# EAGLE design MintyCharger 9V (Rev A) (EAGLE 6.6.0)
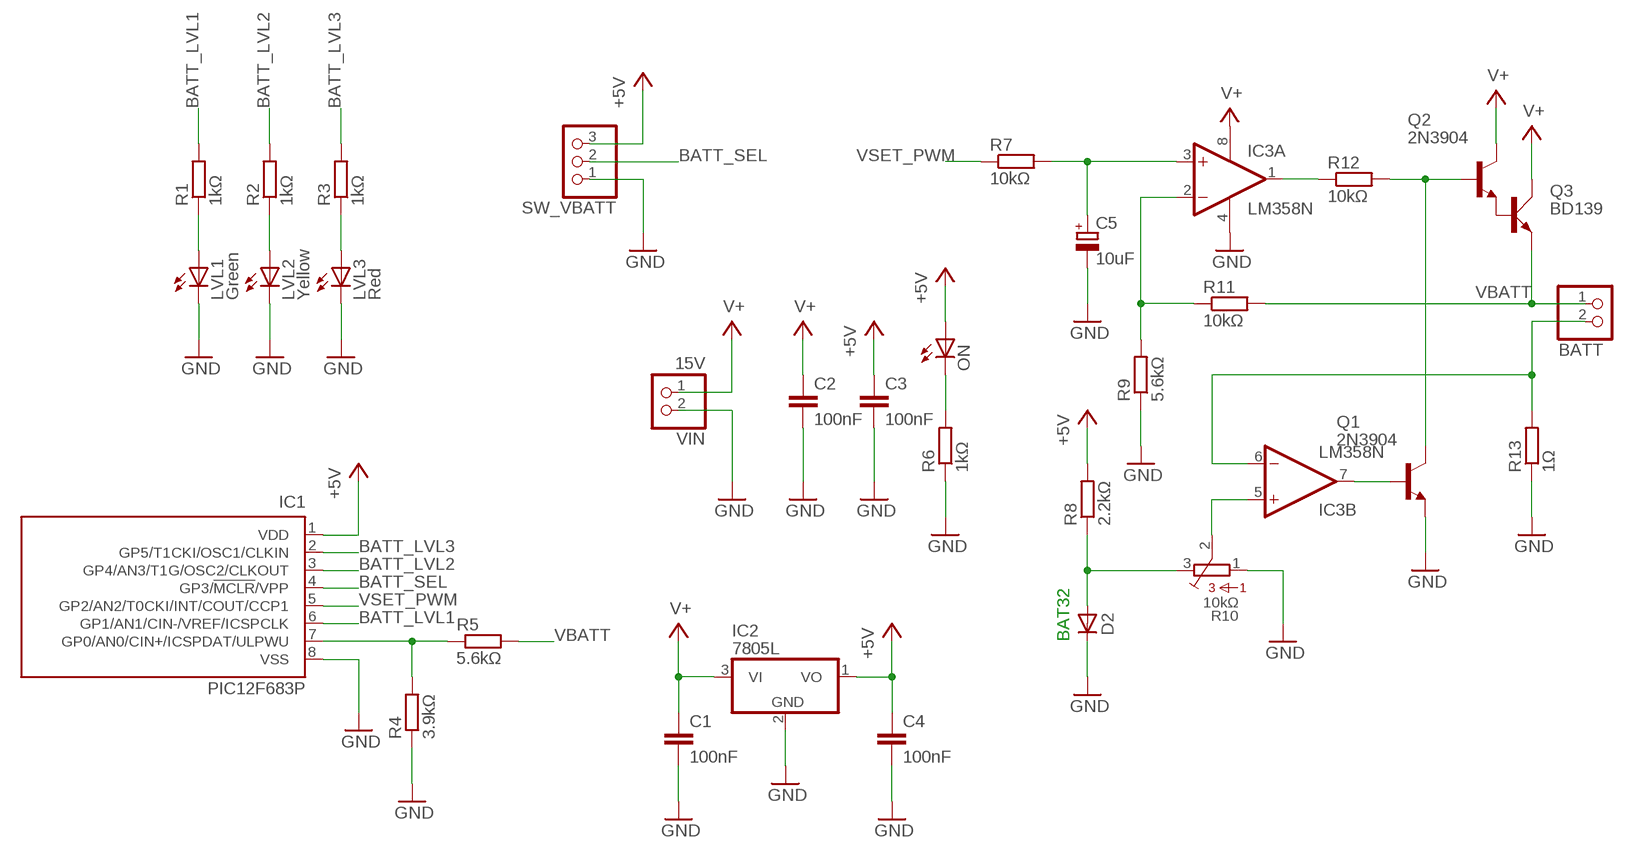
[diagram p0: schematic, sheet 1]

## Parts
BATT  JST_2PIN-THM  [JST-PH-2-THM]
C1  100nF  C-EU025-025X050  [C025-025X050]
C2  100nF  C-EU025-025X050  [C025-025X050]
C3  100nF  C-EU025-025X050  [C025-025X050]
C4  100nF  C-EU025-025X050  [C025-025X050]
C5  10uF  CPOL-EUE2.5-6  [E2,5-6]
D2  1N4148DO35-7  [DO35-7]
IC1  PIC12F683P  [DIL8]
IC2  7805L  [TO92]
IC3  LM358N  [DIL08]
LVL1  Green  LEDSQR2X5  [LED2X5]
LVL2  Yellow  LEDSQR2X5  [LED2X5]
LVL3  Red  LEDSQR2X5  [LED2X5]
ON  LEDSQR2X5  [LED2X5]
Q1  2N3904  [TO92]
Q2  2N3904  [TO92]
Q3  BD139  [TO126AV]
R1  1kΩ  R-EU_0207/10  [0207/10]
R2  1kΩ  R-EU_0207/10  [0207/10]
R3  1kΩ  R-EU_0207/10  [0207/10]
R4  3.9kΩ  R-EU_0207/10  [0207/10]
R5  5.6kΩ  R-EU_0207/10  [0207/10]
R6  1kΩ  R-EU_0207/10  [0207/10]
R7  10kΩ  R-EU_0207/10  [0207/10]
R8  2.2kΩ  R-EU_0207/10  [0207/10]
R9  5.6kΩ  R-EU_0207/10  [0207/10]
R10  10kΩ  3362U  [3362U]
R11  10kΩ  R-EU_0207/10  [0207/10]
R12  10kΩ  R-EU_0207/10  [0207/10]
R13  1Ω  R-EU_0207/10  [0207/10]
SW_VBATT  PINHD-1X3  [1X03]
VIN  15V  JST_2PIN-THM  [JST-PH-2-THM]

## Nets
+5V: C3.1 C4.1 IC1.1(VDD) IC2.1(VO) ON.A R8.2 SW_VBATT.3
BATT_LVL1: IC1.6(GP1/AN1/CIN-/VREF/ICSPCLK) R1.2
BATT_LVL2: IC1.3(GP4/AN3/T1G/OSC2/CLKOUT) R2.2
BATT_LVL3: IC1.2(GP5/T1CKI/OSC1/CLKIN) R3.2
BATT_SEL: IC1.4(GP3/!MCLR!/VPP) SW_VBATT.2
GND: C1.2 C2.2 C3.2 C4.2 C5.- D2.C IC1.8(VSS) IC2.2(GND) IC3.4(P:V-) LVL1.K(C) LVL2.K(C) LVL3.K(C) Q1.3(E) R4.1 R6.1 R9.1 R10.1 R13.1 SW_VBATT.1 VIN.2
ISENSE: BATT.2 IC3.6(B:-IN) R13.2
N$1: LVL1.A R1.1
N$2: IC3.2(A:-IN) R9.2 R11.1
N$3: IC3.1(A:OUT) R12.1
N$4: Q2.3(E) Q3.B
N$5: Q1.1(C) Q2.2(B) R12.2
N$6: IC3.7(B:OUT) Q1.2(B)
N$7: D2.A R8.1 R10.3
N$8: IC3.5(B:+IN) R10.2
N$9: IC1.7(GP0/AN0/CIN+/ICSPDAT/ULPWU) R4.2 R5.1
N$10: LVL2.A R2.1
N$11: LVL3.A R3.1
N$22: ON.K(C) R6.2
V+: C1.1 C2.1 IC2.3(VI) IC3.8(P:V+) Q2.1(C) Q3.C VIN.1
VBATT: BATT.1 Q3.E R5.2 R11.2
VOUT: C5.+ IC3.3(A:+IN) R7.2
VSET_PWM: IC1.5(GP2/AN2/T0CKI/INT/COUT/CCP1) R7.1

## Notes on the sheet
- BAT32

## Library data of the parts
BATT VIN = adafruit:JST_2PIN: JST 2-Pin Connectors of various flavors SMT-RA (S2B-PH-SM4) 4UConnector #17311 SMT (B2B-PH-SM4) THM-RA (S2B-PH) THM (B2B-PH)
C1-C4 = rcl:C-EU: CAPACITOR, European symbol
C5 = rcl:CPOL-EU: POLARIZED CAPACITOR, European symbol
D2 = diode:1N4148: DIODE high speed (Philips)
IC1 = microchip:PIC12F683: 8-Pin Flash-Based, 8-Bit CMOS Microcontrollers with nanoWatt Technology Source: http://ww1.microchip.com/downloads/en/DeviceDoc/41211D_.pdf; MF: MICROCHIP; MPN: PIC12F683-I/P; OC_FARNELL: 9759034; OC_NEWARK: 89H0442
IC2 = linear:78*: Positive VOLTAGE REGULATOR Source: http://cache.national.com/ds/LM/LM78L05.pdf http://www.fairchildsemi.com/ds/LM/LM7805.pdf
IC3 = linear:LM358: OP AMP also LM158; LM258; LM2904 Source: http://cache.national.com/ds/LM/LM158.pdf
LVL1-LVL3 ON = led:LED: LED OSRAM: - CHIPLED LG R971, LG N971, LY N971, LG Q971, LY Q971, LO R971, LY R971 LH N974, LH R974 LS Q976, LO Q976, LY Q976 LO Q996 - Hyper CHIPLED LW Q18S LB Q993, LB Q99A, LB R99A - SideLED LS A670, LO A670, LY A670, LG A670, LP A670 LB A673, LV A673, LT A673, LW A673 LH A674 LY A675 LS A676, LA A676, LO A676, LY A676, LW A676 LS A679, LY A679, LG A679 - Hyper Micro SIDELED® LS Y876, LA Y876, LO Y876, LY Y876 LT Y87S - SmartLED LW L88C, LW L88S LB L89C, LB L89S, LG L890 LS L89K, LO L89K, LY L89K LS L896, LA L896, LO L896, LY L896 - TOPLED LS T670, LO T670, LY T670, LG T670, LP T670 LSG T670, LSP T670, LSY T670, LOP T670, LYG T670 LG T671, LOG T671, LSG T671 LB T673, LV T673, LT T673, LW T673 LH T674 LS T676, LA T676, LO T676, LY T676, LB T676, LH T676, LSB T676, LW T676 LB T67C, LV T67C, LT T67C, LS T67K, LO T67K, LY T67K, LW E67C LS E67B, LA E67B, LO E67B, LY E67B, LB E67C, LV E67C, LT E67C LW T67C LS T679, LY T679, LG T679 LS T770, LO T770, LY T770, LG T770, LP T770 LB T773, LV T773, LT T773, LW T773 LH T774 LS E675, LA E675, LY E675, LS T675 LS T776, LA T776, LO T776, LY T776, LB T776 LHGB T686 LT T68C, LB T68C - Hyper Mini TOPLED® LB M676 - Mini TOPLED Santana® LG M470 LS M47K, LO M47K, LY M47K Source: http://www.osram.convergy.de LUXEON: - LUMILED® LXK2-PW12-R00, LXK2-PW12-S00, LXK2-PW14-U00, LXK2-PW14-V00 LXK2-PM12-R00, LXK2-PM12-S00, LXK2-PM14-U00 LXK2-PE12-Q00, LXK2-PE12-R00, LXK2-PE12-S00, LXK2-PE14-T00, LXK2-PE14-U00 LXK2-PB12-K00, LXK2-PB12-L00, LXK2-PB12-M00, LXK2-PB14-N00, LXK2-PB14-P00, LXK2-PB14-Q00 LXK2-PR12-L00, LXK2-PR12-M00, LXK2-PR14-Q00, LXK2-PR14-R00 LXK2-PD12-Q00, LXK2-PD12-R00, LXK2-PD12-S00 LXK2-PH12-R00, LXK2-PH12-S00 LXK2-PL12-P00, LXK2-PL12-Q00, LXK2-PL12-R00 Source: www.luxeon.com KINGBRIGHT: KA-3528ASYC Source: www.kingbright.com
Q1 Q2 = transistor-npn:2N3904: NPN Transistor
Q3 = transistor-power:BD139: NPN TRANSISTOR
R1-R4 R6 R8 R9 R11-R13 = rcl:R-EU_: RESISTOR, European symbol
R5 R7 = resistor:R-EU_: RESISTOR, European symbol
R10 = bourns:3362: 3362 Series 1/4" Square Trimmer
SW_VBATT = pinhead:PINHD-1X3: PIN HEADER

## Board
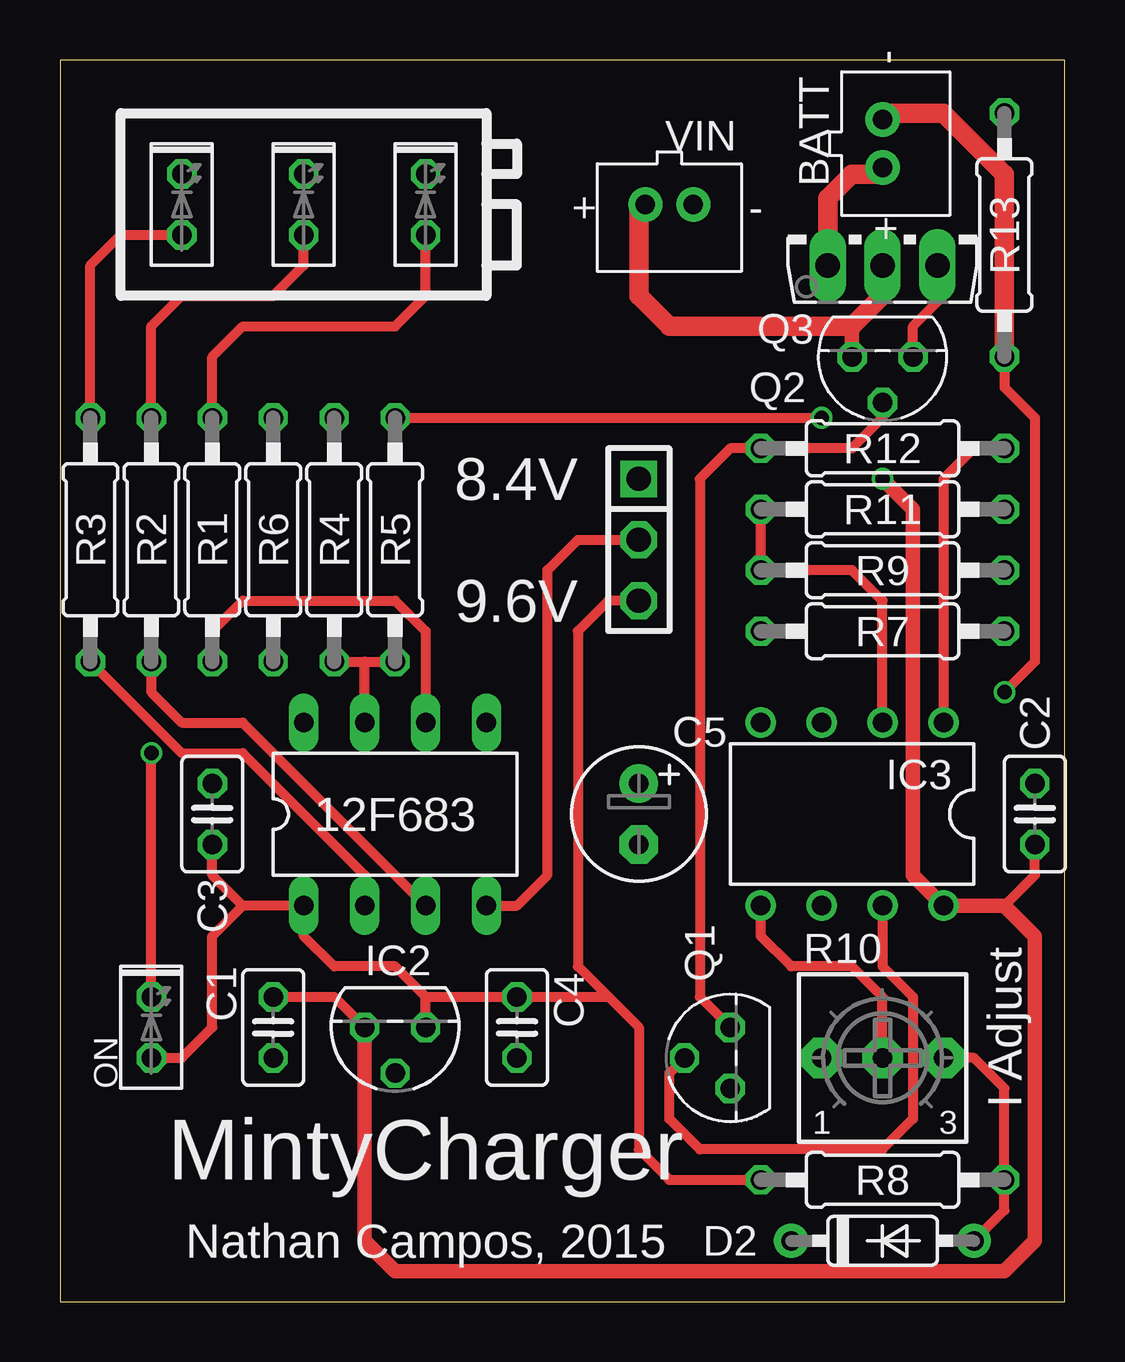
[diagram p1: board, top side]
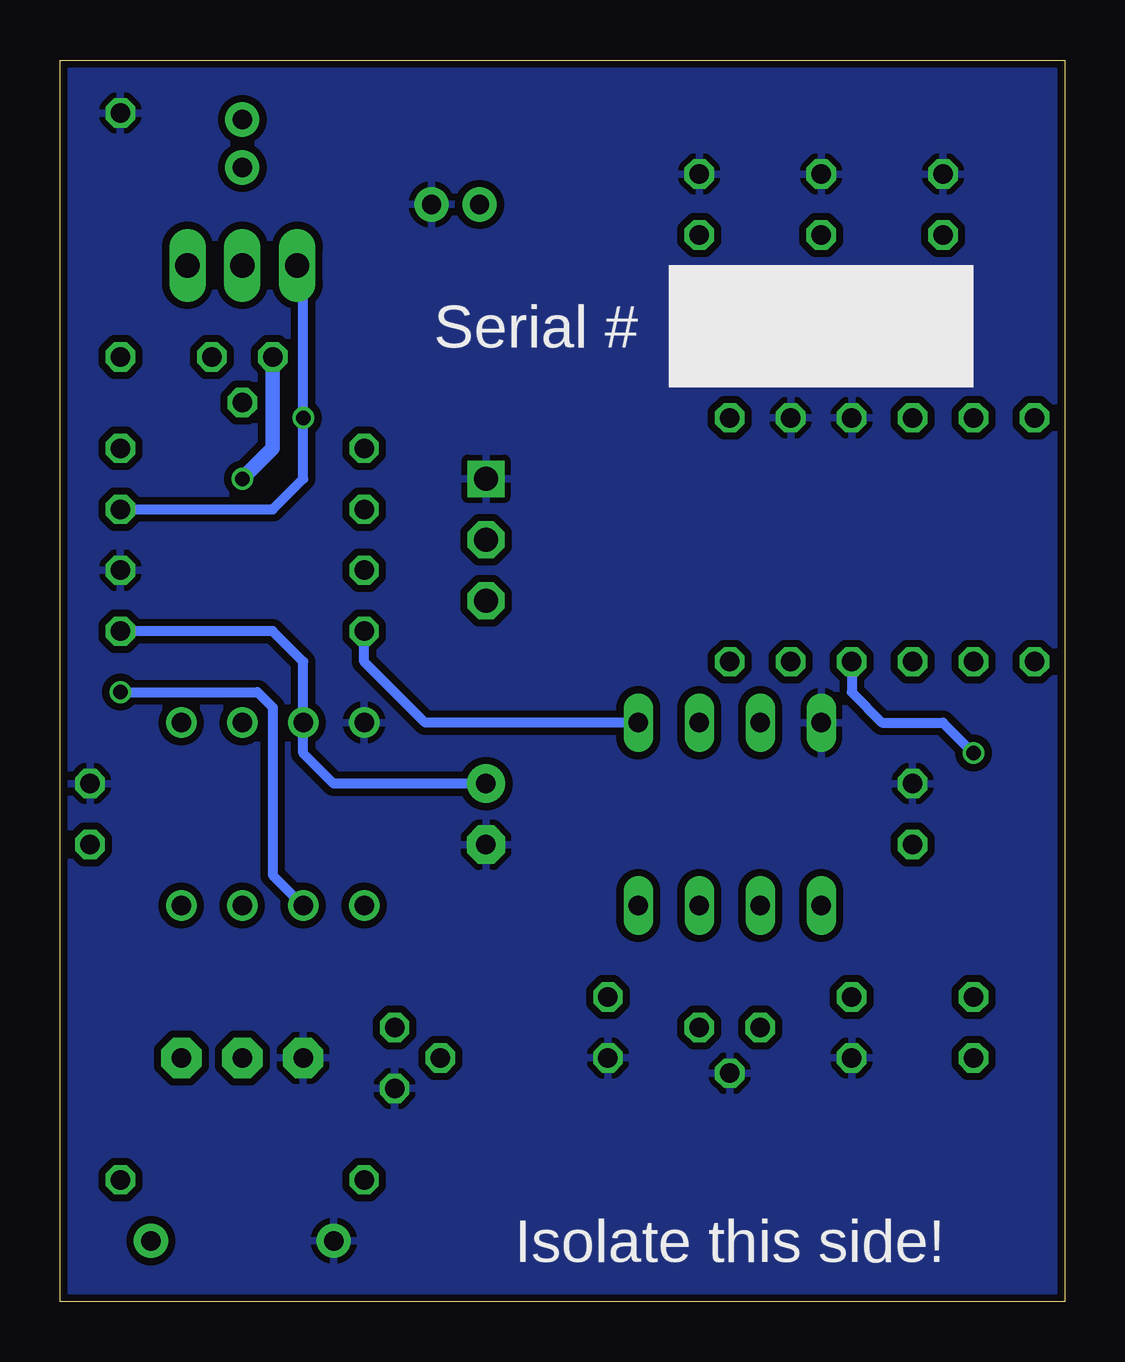
[diagram p2: board, bottom side, seen from below]

Size 41.89 x 51.74 mm. Coordinates in mm from the lower left corner, seen from the top.
Outline: 0,0 41.89,0 41.89,51.74 0,51.74 0,0
Copper layers (1*2*15*16): Top 0.035mm / dielectric 0.2mm / Route2 0.0175mm / dielectric 1.1mm / Route15 0.0175mm / dielectric 0.2mm / Bottom 0.035mm
Design rules "SeeedStudio_DRU_no_angle_20130527": minimum track width 6mil, minimum drill 12mil, track to track 6mil, track to pad 6mil, pad to pad 6mil, via to via 6mil, smd to smd 0mil, copper to edge 10mil, drill to drill 10mil, minimum pad ring 6mil, minimum via ring 6mil, stop-mask expansion 2mil, vias tented up to drill 25mil, thermal gap 10mil

### Footprints (pad centres in the part's own frame; a part is rotated, then mirrored left to right if it is on the bottom)
JST-PH-2-THM = drill 0.8 pad 1.422: 1 1,0; 2 -1,0
C025-025X050 = drill 0.813 octagon: 1 -1.27,0; 2 1.27,0
E2,5-6 = drill 0.813 pad 1.6: + -1.27,0 | drill 0.813 pad 1.6 octagon: - 1.27,0
DO35-7 = drill 0.813 pad 1.422: A 3.81,0; C -3.81,0
DIL8 = drill 0.813 long: 1 -3.81,-3.81; 2 -1.27,-3.81; 3 1.27,-3.81; 4 3.81,-3.81; 5 3.81,3.81; 6 1.27,3.81; 7 -1.27,3.81; 8 -3.81,3.81
TO92 = drill 0.813 octagon: 1 -1.27,0; 2 0,1.905; 3 1.27,0
DIL08 = drill 0.813 pad 1.27: 1 -3.81,-3.81; 2 -1.27,-3.81; 3 1.27,-3.81; 4 3.81,-3.81; 5 3.81,3.81; 6 1.27,3.81; 7 -1.27,3.81; 8 -3.81,3.81
LED2X5 = drill 0.813 octagon: A -1.27,0; K 1.27,0
TO92' = drill 0.813 octagon: 1 1.27,0; 2 0,1.905; 3 -1.27,0
TO126AV = drill 1.016 long: B 2.286,-1.27; C 0,-1.27; E -2.286,-1.27
0207/10 = drill 0.813 octagon: 1 -5.08,0; 2 5.08,0
3362U = drill 0.813 pad 1.676 octagon: 1 -2.54,0; 2 0,0; 3 2.54,0
1X03 = drill 1.016 square: 1 -2.54,0 | drill 1.016 octagon: 2 0,0; 3 2.54,0

### Placement (x,y rotation side)
BATT  34.29,48.26 270 top
C1  8.89,11.43 270 top
C2  40.64,20.32 90 top
C3  6.35,20.32 90 top
C4  19.05,11.43 270 top
C5  24.13,20.32 270 top
D2  34.29,2.54 0 top
IC1  13.97,20.32 0 top
IC2  13.97,11.43 180 top
IC3  33.02,20.32 180 top
LVL1  15.24,45.72 90 top
LVL2  10.16,45.72 90 top
LVL3  5.08,45.72 90 top
ON  3.81,11.43 90 top
Q1  2N3904  [TO92']  27.94,10.16 90 top
Q2  2N3904  [TO92']  34.29,39.37 180 top
Q3  34.29,44.45 0 top
R1  6.35,31.75 270 top
R2  3.81,31.75 270 top
R3  1.27,31.75 270 top
R4  11.43,31.75 270 top
R5  13.97,31.75 90 top
R6  8.89,31.75 270 top
R7  34.29,27.94 0 top
R8  34.29,5.08 180 top
R9  34.29,30.48 180 top
R10  34.29,10.16 0 top
R11  34.29,33.02 0 top
R12  34.29,35.56 180 top
R13  39.37,44.45 270 top
SW_VBATT  24.13,31.75 270 top
VIN  25.4,45.72 180 top

### Tracks (layer width: path | path; a pad name or v marks a point on that pad's centre or on a via)
+5V
  Top 0.406: IC2.1 15.24,12.7 | 15.24,12.7 13.97,13.97 11.43,13.97 10.16,15.24 IC1.1 7.62,16.51 | 15.24,12.7 C4.1 22.86,12.7 | 22.86,12.7 24.13,11.43 24.13,6.35 25.4,5.08 R8.2 | 7.62,16.51 6.35,17.78 C3.1 | ON.A 5.08,10.16 6.35,11.43 6.35,15.24 7.62,16.51 | SW_VBATT.3 22.86,29.21 21.59,27.94 21.59,13.97 22.86,12.7
BATT_LVL1
  Top 0.406: R1.2 6.35,27.94 7.62,29.21 13.97,29.21 15.24,27.94 IC1.6
BATT_LVL2
  Top 0.406: R2.2 3.81,25.4 5.08,24.13 7.62,24.13 IC1.3
BATT_LVL3
  Top 0.406: R3.2 5.08,22.86 7.62,22.86 12.7,17.78 IC1.2
BATT_SEL
  Top 0.406: IC1.4 19.05,16.51 20.32,17.78 20.32,30.48 21.59,31.75 SW_VBATT.2
GND
  pour Bottom (isolate 0.305): 0,52.07 0,0 41.91,0 41.91,52.07
ISENSE  (via drill 0.6)
  Top 0.406: R13.2 39.37,38.1 40.64,36.83 40.64,26.67 v39.37,25.4
  Top 0.813: R13.2 39.37,46.99 36.83,49.53 34.56,49.53 BATT.2
  Bottom 0.406: v39.37,25.4 33.66,25.4 33.02,24.77 33.02,17.78 IC3.6
N$1
  Top 0.406: R1.1 6.35,39.37 7.62,40.64 13.97,40.64 15.24,41.91 LVL1.A
N$2
  Top 0.406: IC3.2 34.29,29.21 33.02,30.48 R9.2 R11.1
N$3
  Top 0.406: R12.1 38.1,35.56 36.83,34.29 IC3.1
N$4
  Top 0.406: Q2.3 35.56,40.64 36.83,41.91 36.83,42.93 Q3.B
N$5
  Top 0.406: Q2.2 34.29,36.83 33.02,35.56 R12.2 27.94,35.56 26.67,34.29 26.67,12.7 Q1.1
N$6
  Top 0.406: IC3.7 34.29,13.97 35.56,12.7 35.56,7.62 34.29,6.35 26.67,6.35 25.4,7.62 25.4,9.53 Q1.2
N$7
  Top 0.406: D2.A 39.37,3.81 R8.1 39.37,8.89 38.1,10.16 R10.3
N$8
  Top 0.406: R10.2 34.29,12.7 33.02,13.97 30.48,13.97 29.21,15.24 IC3.5
N$9
  Top 0.406: R4.2 12.7,26.67 | 12.7,26.67 R5.1 | IC1.7 12.7,26.67
N$10
  Top 0.406: R2.1 3.81,40.64 5.08,41.91 8.89,41.91 10.16,43.18 LVL2.A
N$11
  Top 0.406: R3.1 1.27,43.18 2.54,44.45 LVL3.A
N$22  (via drill 0.6)
  Top 0.406: ON.K v3.81,22.86
  Bottom 0.406: R6.2 8.89,25.4 7.62,24.13 5.08,24.13 v3.81,22.86
V+  (via drill 0.6)
  Top 0.406: 39.37,16.51 40.64,17.78 C2.1 | C1.1 11.43,12.7 IC2.3
  Top 0.61: v34.29,34.29 35.56,33.02 35.56,17.78 IC3.8 39.37,16.51 40.64,15.24 40.64,2.54 39.37,1.27 13.97,1.27 12.7,2.54 IC2.3 | Q2.1 33.02,40.64
  Top 0.813: Q3.C 34.29,41.91 33.02,40.64 25.4,40.64 24.13,41.91 24.13,45.45 VIN.1
  Bottom 0.61: Q2.1 33.02,35.56 v34.29,34.29
VBATT  (via drill 0.6)
  Top 0.406: R5.2 v31.75,36.83
  Top 0.813: Q3.E 32,45.97 33.02,46.99 34.02,46.99 BATT.1
  Bottom 0.406: R11.2 33.02,33.02 31.75,34.29 v31.75,36.83 31.75,42.93 Q3.E
VOUT
  Bottom 0.406: R7.2 33.02,27.94 31.75,26.67 IC3.3 31.75,22.86 30.48,21.59 C5.+
VSET_PWM
  Bottom 0.406: IC1.5 26.67,24.13 29.21,26.67 R7.1

### Text on the board
tPlace: 8.4V | 9.6V | 12F683 | I Adjust | MintyCharger | Nathan Campos, 2015
bPlace: Serial # | Isolate this side!